# EAGLE schematic kolektorius_v2.2_ch340g (EAGLE 6.5.0)
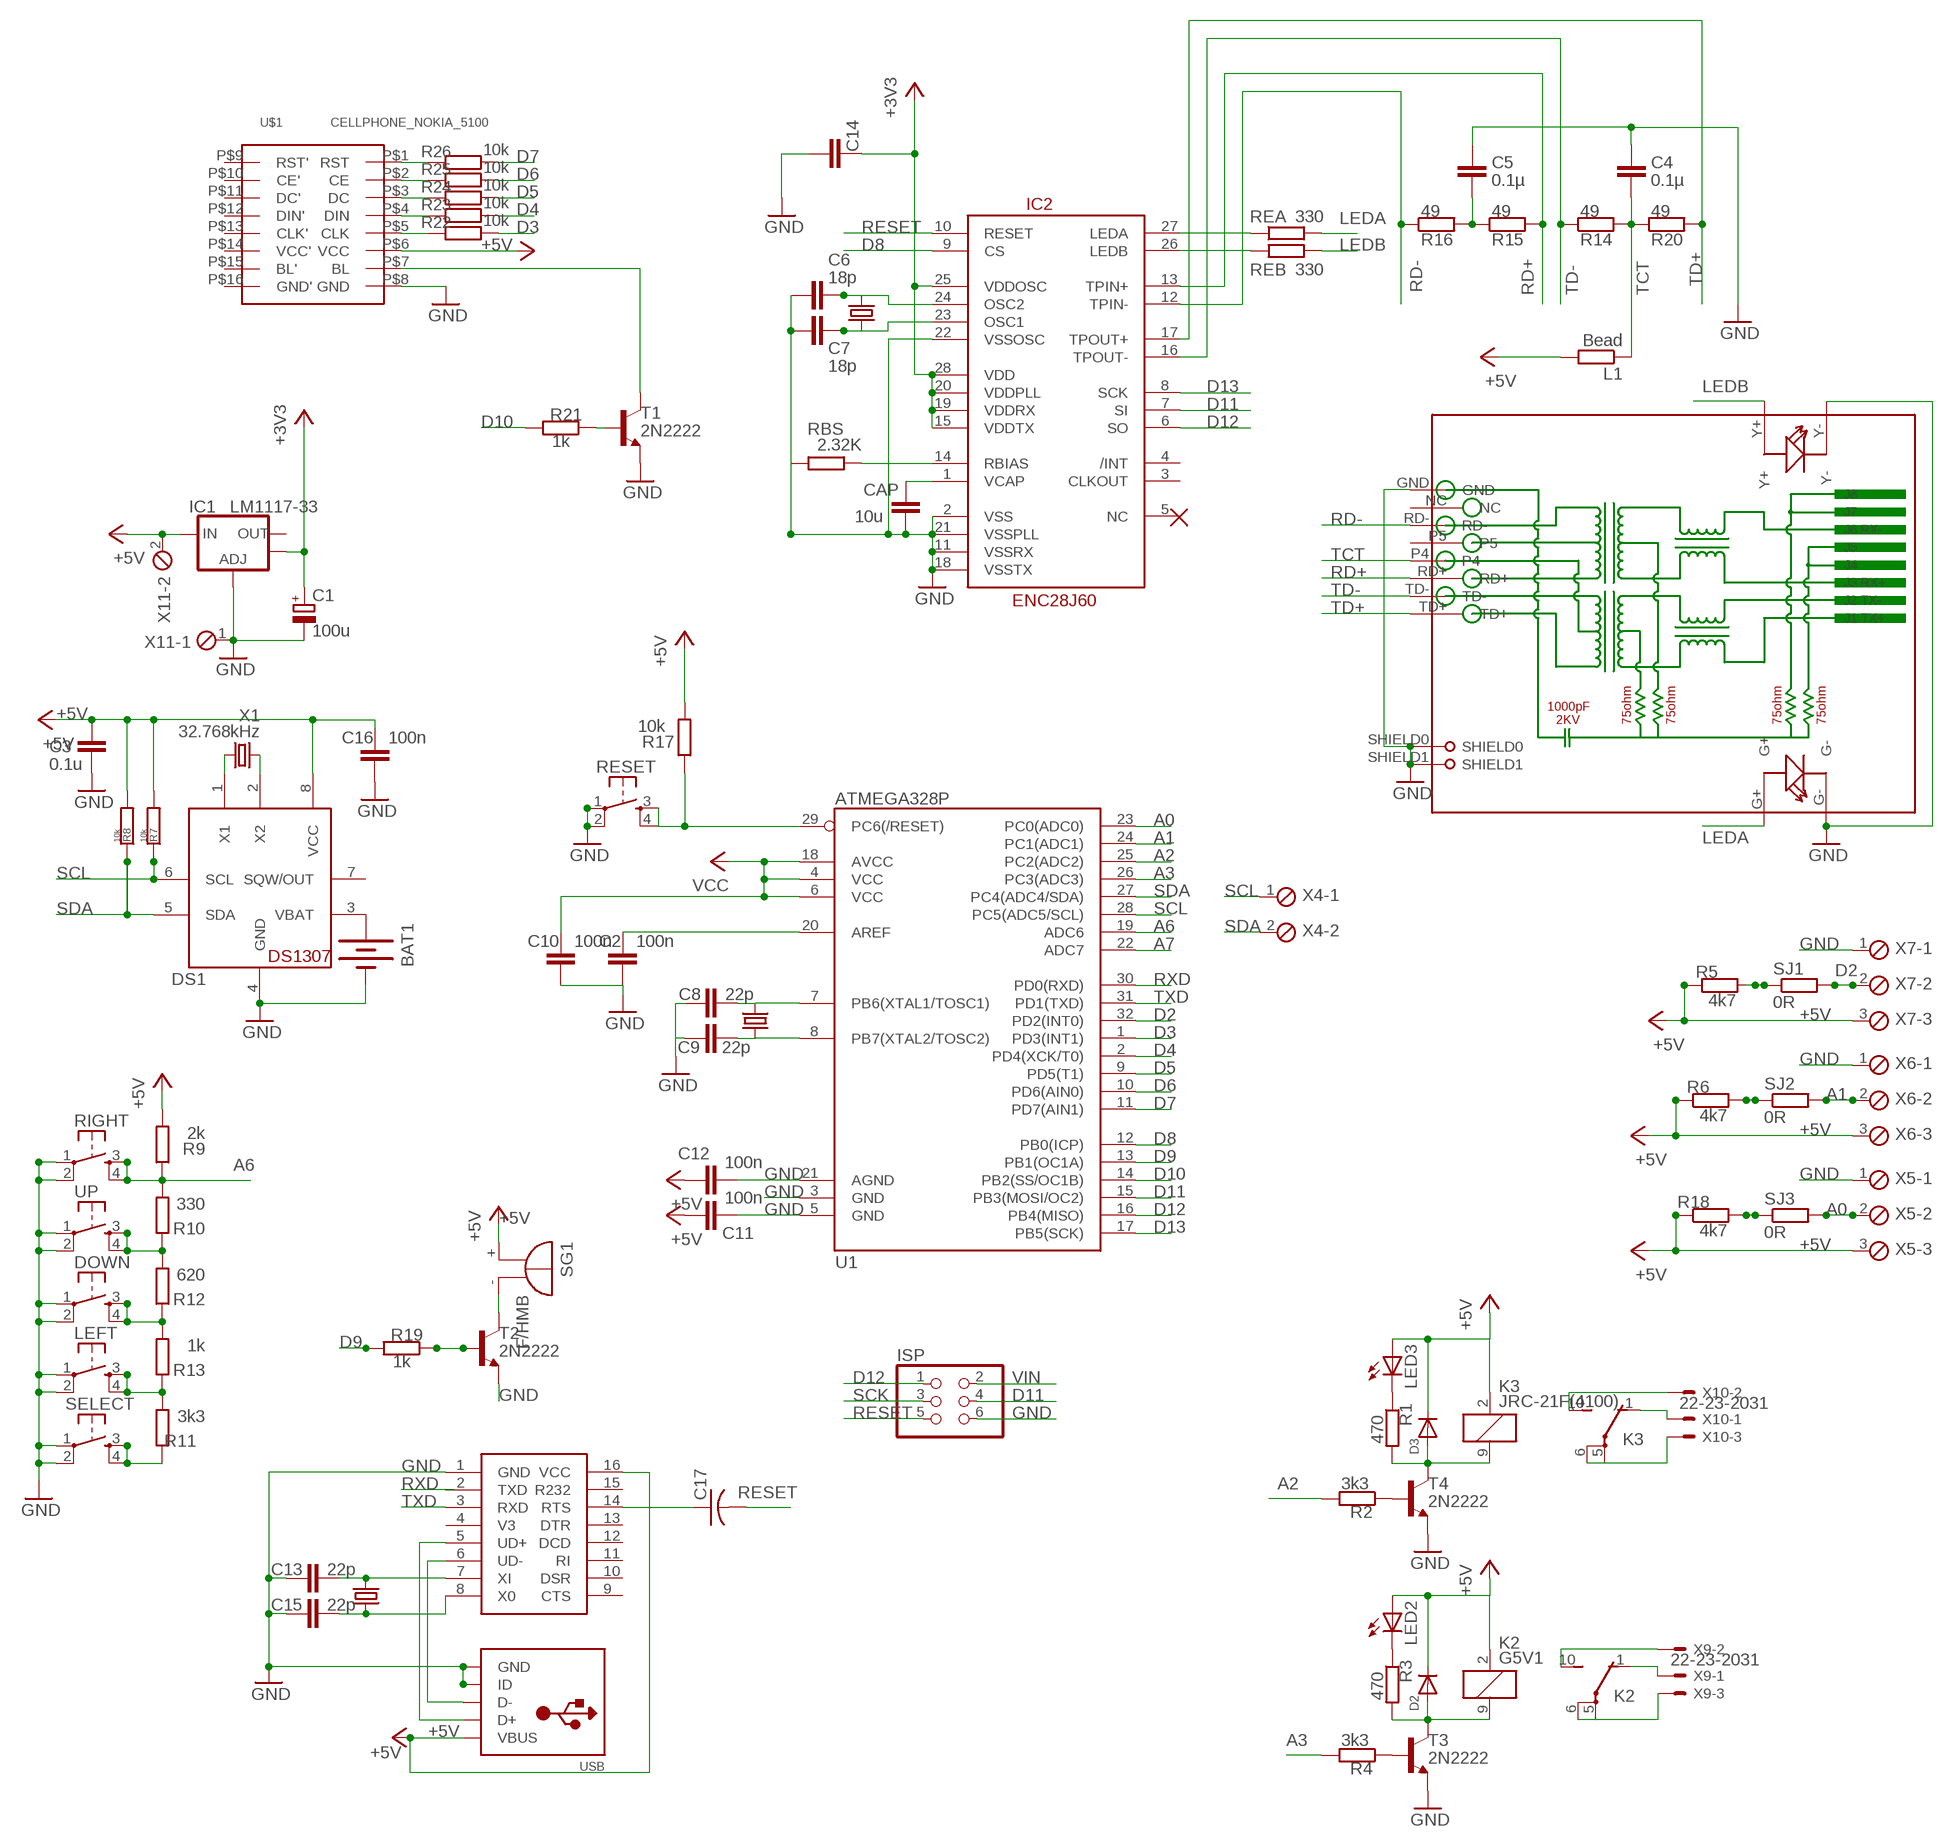
[diagram p0: schematic, sheet 1]

## Parts
BAT1  BATTERY20PTH  [BATTCOM_20MM_PTH]
C1  100u  CPOL-EUE2-5  [E2-5]
C2  100n  C-EUC0805  [C0805]
C3  0.1u  C-EUC0805  [C0805]
C4  0.1µ  C-EUC0805  [C0805]
C5  0.1µ  C-EUC0805  [C0805]
C6  18p  C-EUC0805  [C0805]
C7  18p  C-EUC0805  [C0805]
C8  22p  C-EUC0805  [C0805]
C9  22p  C-EUC0805  [C0805]
C10  100n  C-EUC0805  [C0805]
C11  100n  C-EUC0805  [C0805]
C12  100n  C-EUC0805  [C0805]
C13  22p  C-EUC0805  [C0805]
C14  100n  C-EUC0805  [C0805]
C15  22p  C-EUC0805  [C0805]
C16  100n  C-EUC0805  [C0805]
C17  C-USC0805K  [C0805K]
CAP  10u  C-EUC0805  [C0805]
D2  DIODEDO-1N4148  [DO-1N4148]
D3  DIODEDO-1N4148  [DO-1N4148]
DOWN  TAC_SWITCHPTH  [TACTILE-PTH]
DS1  DS1307  DS1307SOIC  [SO08]
IC1  LM1117-33  V_REG_LM1117SOT223  [SOT223]
IC2  ENC28J60  [SSOP28DB]
ISP  PINHD-2X3  [2X03]
K2  G5V1  [G5V1]
K3  JRC-21F(4100)  [G5V1]
L1  Bead  R-EU_R0805  [R0805]
LED2  LEDSMT1206  [1206]
LED3  LEDSMT1206  [1206]
LEFT  TAC_SWITCHPTH  [TACTILE-PTH]
R1  470  R-EU_R0805  [R0805]
R2  3k3  R-EU_R0805  [R0805]
R3  470  R-EU_R0805  [R0805]
R4  3k3  R-EU_R0805  [R0805]
R5  4k7  R-EU_R0805  [R0805]
R6  4k7  R-EU_R0805  [R0805]
R7  10k  R-EU_R0805  [R0805]
R8  10k  R-EU_R0805  [R0805]
R9  2k  R-EU_R0805  [R0805]
R10  330  R-EU_R0805  [R0805]
R11  3k3  R-EU_R0805  [R0805]
R12  620  R-EU_R0805  [R0805]
R13  1k  R-EU_R0805  [R0805]
R14  49  R-EU_R0805  [R0805]
R15  49  R-EU_R0805  [R0805]
R16  49  R-EU_R0805  [R0805]
R17  10k  R-EU_R0805  [R0805]
R18  4k7  R-EU_R0805  [R0805]
R19  1k  R-EU_R0805  [R0805]
R20  49  R-EU_R0805  [R0805]
R21  1k  R-EU_R0805  [R0805]
R22  10k  R-EU_R0805  [R0805]
R23  10k  R-EU_R0805  [R0805]
R24  10k  R-EU_R0805  [R0805]
R25  10k  R-EU_R0805  [R0805]
R26  10k  R-EU_R0805  [R0805]
RBS  2.32K  R-EU_R0805  [R0805]
REA  330  R-EU_R0805  [R0805]
REB  330  R-EU_R0805  [R0805]
RESET  TAC_SWITCHPTH  [TACTILE-PTH]
RIGHT  TAC_SWITCHPTH  [TACTILE-PTH]
RJ1  HR911105A  [HR911105A]
SELECT  TAC_SWITCHPTH  [TACTILE-PTH]
SG1  F/HMB  [F/HMB]
SJ1  0R  R-EU_R0402  [R0402]
SJ2  0R  R-EU_R0402  [R0402]
SJ3  0R  R-EU_R0402  [R0402]
T1  2N2222  [TO92-EBC-OVAL]
T2  2N2222  [TO92-EBC-OVAL]
T3  2N2222  [TO92-EBC-OVAL]
T4  2N2222  [TO92-EBC-OVAL]
U1  ATMEGA328P  ATMEGA328_SMT  [TQFP32-08]
U$1  CELLPHONE_NOKIA_5100  [CELLPHONE_NOKIA_5100_SPARKFUN]
U$2  CH340G  [SO016]
UP  TAC_SWITCHPTH  [TACTILE-PTH]
USB  USBMOLEX  [USB-MINIB-THM-MOLEX]
X1  32.768kHz  CRYSTALTC26H  [TC26H]
X2  16MHz  CRYSTALHC49US  [HC49US]
X3  25MHz  CRYSTALHC49US  [HC49US]
X4  MPT2  [2POL254]
X5  MPT3  [3POL254]
X6  MPT3  [3POL254]
X7  MPT3  [3POL254]
X9  22-23-2031  [22-23-2031]
X10  22-23-2031  [22-23-2031]
X11  MPT2  [2POL254]
X12  16MHz  CRYSTALHC49US  [HC49US]

## Nets
+3V3: C1.+ C14.1 IC1.4(OUT) IC2.15(VDDTX) IC2.19(VDDRX) IC2.20(VDDPLL) IC2.25(VDDOSC) IC2.28(VDD)
+5V: C3.1 C10.1 C11.2 C12.2 C16.1 D2.C D3.C DS1.8(VCC) IC1.3(IN) K2.2 K3.2 L1.2 LED2.A LED3.A R5.1 R6.1 R7.2 R8.2 R9.2 R17.2 R18.1 SG1.+ U1.4(VCC) U1.6(VCC) U1.18(AVCC) U$1.P$6(VCC) U$2.16(VCC) USB.VBUS X5.3 X6.3 X7.3 X11.2 ; supply symbol labelled VCC
A0: SJ3.2 U1.23(PC0(ADC0)) X5.2
A1: SJ2.2 U1.24(PC1(ADC1)) X6.2
A2: R2.2 U1.25(PC2(ADC2))
A3: R4.2 U1.26(PC3(ADC3))
A6: R9.1 R10.2 RIGHT.3 RIGHT.4 U1.19(ADC6)
A7: U1.22(ADC7)
D2: SJ1.2 U1.32(PD2(INT0)) X7.2
D3: R22.2 U1.1(PD3(INT1))
D4: R23.2 U1.2(PD4(XCK/T0))
D5: R24.2 U1.9(PD5(T1))
D6: R25.2 U1.10(PD6(AIN0))
D7: R26.2 U1.11(PD7(AIN1))
D8: IC2.9(CS) U1.12(PB0(ICP))
D9: R19.2 U1.13(PB1(OC1A))
D10: R21.2 U1.14(PB2(SS/OC1B))
D11: IC2.7(SI) ISP.4 U1.15(PB3(MOSI/OC2))
D12: IC2.6(SO) ISP.1 U1.16(PB4(MISO))
D13: IC2.8(SCK) U1.17(PB5(SCK))
GND: BAT1.2(-) C1.- C2.2 C3.2 C4.1 C5.1 C6.2 C7.2 C8.1 C9.1 C10.2 C11.1 C12.1 C13.1 C14.2 C15.1 C16.2 CAP.2 DOWN.1 DOWN.2 DS1.4(GND) IC1.1(ADJ) IC2.2(VSS) IC2.11(VSSRX) IC2.18(VSSTX) IC2.21(VSSPLL) IC2.22(VSSOSC) ISP.6 LEFT.1 LEFT.2 RBS.1 RESET.1 RESET.2 RIGHT.1 RIGHT.2 RJ1.G- RJ1.GND RJ1.SHIELD0 RJ1.SHIELD1 RJ1.Y- SELECT.1 SELECT.2 T1.E T2.E T3.E T4.E U1.3(GND) U1.5(GND) U1.21(AGND) U$1.P$8(GND) U$2.1(GND) UP.1 UP.2 USB.GND USB.ID X5.1 X6.1 X7.1 X11.1
LEDA: REA.2 RJ1.G+
LEDB: REB.2 RJ1.Y+
N$1: LEFT.3 LEFT.4 R11.2 R13.1
N$2: D2.A K2.9 R3.2 T3.C
N$3: R4.1 T3.B
N$4 [power]: K2.5(2:P) K2.6(2:P) X9.3
N$5: K2.10(2:S) X9.2
N$6: DOWN.3 DOWN.4 R12.1 R13.2
N$7: LED2.C R3.1
N$8: DS1.1(X1) X1.2
N$9: R10.1 R12.2 UP.3 UP.4
N$10: C13.2 U$2.7(XI) X12.2
N$11: U$2.6(UD-) USB.D-
N$12: D3.A K3.9 R1.2 T4.C
N$13: R2.1 T4.B
N$14: K2.1(2:O) X9.1
N$15: U$2.5(UD+) USB.D+
N$16: K3.10(2:S) X10.2
N$17: R6.2 SJ2.1
N$18: R11.1 SELECT.3 SELECT.4
N$19 [power]: K3.5(2:P) K3.6(2:P) X10.3
N$20: K3.1(2:O) X10.1
N$21: LED3.C R1.1
N$22: R22.1 U$1.P$5(CLK)
N$23: R25.1 U$1.P$2(CE)
N$24: R24.1 U$1.P$3(DC)
N$25: R23.1 U$1.P$4(DIN)
N$26 [signal]: T1.C U$1.P$7(BL)
N$27: R19.1 T2.B
N$28: R18.2 SJ3.1
N$29: SG1.- T2.C
N$30: DS1.2(X2) X1.1
N$31: R5.2 SJ1.1
N$32: C9.2 U1.8(PB7(XTAL2/TOSC2)) X2.1
N$33: C8.2 U1.7(PB6(XTAL1/TOSC1)) X2.2
N$34: IC2.27(LEDA) REA.1
N$35: C2.1 U1.20(AREF)
N$36: BAT1.1(+) DS1.3(VBAT)
N$37: IC2.26(LEDB) REB.1
N$39: CAP.1 IC2.1(VCAP)
N$40: C15.2 U$2.8(X0) X12.1
N$41: C6.1 IC2.24(OSC2) X3.2
N$42: C7.1 IC2.23(OSC1) X3.1
N$43: C17.1 U$2.14(RTS)
N$44: R21.1 T1.B
N$46: R17.1 RESET.3 RESET.4 U1.29(PC6(/RESET))
N$54: C5.2 R15.1 R16.2
N$59: IC2.14(RBIAS) RBS.2
RD+: IC2.13(TPIN+) R15.2 RJ1.RD+
RD-: IC2.12(TPIN-) R16.1 RJ1.RD-
RESET: C17.2 IC2.10(RESET) ISP.5
RXD: U1.30(PD0(RXD))
SCK: ISP.3
SCL: DS1.6(SCL) R7.1 U1.28(PC5(ADC5/SCL)) X4.1
SDA: DS1.5(SDA) R8.1 U1.27(PC4(ADC4/SDA)) X4.2
TCT: C4.2 L1.1 R14.2 R20.1 RJ1.P4
TD+: IC2.17(TPOUT+) R20.2 RJ1.TD+
TD-: IC2.16(TPOUT-) R14.1 RJ1.TD-
TXD: U1.31(PD1(TXD)) U$2.3(RXD)
V$: R26.1 U$1.P$1(RST)
VIN: ISP.2
Unconnected: DS1.7(SQW/OUT) IC1.2(OUT) IC2.3(CLKOUT) IC2.4(/INT) IC2.5(NC) RJ1.NC RJ1.P5 U$1.P$9(RST') U$1.P$10(CE') U$1.P$11(DC') U$1.P$12(DIN') U$1.P$13(CLK') U$1.P$14(VCC') U$1.P$15(BL') U$1.P$16(GND') U$2.2(TXD) U$2.4(V3) U$2.9(CTS) U$2.10(DSR) U$2.11(RI) U$2.12(DCD) U$2.13(DTR) U$2.15(R232)

## Library data of the parts
BAT1 = SparkFun-Electromechanical:BATTERY: Battery Holders Various common sizes : AA, AAA, 20mm coin cell and 12mm coin cell. 20MM_4LEGS, BATT-10373
C1 = resistor:CPOL-EU: POLARIZED CAPACITOR, European symbol
C2 C4-C16 CAP = resistor:C-EU: CAPACITOR, European symbol
C3 = rcl:C-EU: CAPACITOR, European symbol
C17 = rcl:C-US: CAPACITOR, American symbol
D2 D3 = adafruit:DIODE: Diode SMADIODE - SMA Surface Mount Package 20V 1A Schottky Diode Digikey: 641-1014-6-ND DO-1N4148 - Through Hole Small Current Diode SOD-123 20V 1 A (.5mV Vf) Schottky Diode - Digikey: MBRX120TPMSCT-ND SOD-323 10V 570mA (.38mV Vf, 3ns) Schottky Diode - Digikey: ZLLS410CT-ND SOD-523 30V 30mA Schottky Diode (RB751S-40TE61) - Digikey: RB751S-40TE61CT-ND SOT23-R/W - SOT23 Package (R = Solder Paste/Reflow Ovens, W = Hand-Soldering) BAT54Film 40V 300mA - Digikey: 497-7162-1-ND
DOWN LEFT RESET RIGHT SELECT UP = SparkFun-Electromechanical:TAC_SWITCH: Momentary Switch Button commonly used for reset or general input. Spark Fun Electronics SKU : COM-00097 SMT- SWCH-08247
DS1 = adafruit:DS1307: DS1307 Real time clock (RTC) with battery backup ability. Talk to it via i2c
IC1 = SparkFun:V_REG_LM1117: Voltage Regulator LM1117 Standard adjustable voltage regulator but in SMD form. Spark Fun Electronics SKU : COM-00595
IC2 = SparkFun-DigitalIC:ENC28J60: Microchip SPI 10Base ethernet IC
ISP = pinhead:PINHD-2X3: PIN HEADER
K2 = relay:G5V1: RELAY 1 x switch, 0.5 A/125 V AC, 1 A/24 V DC , Omron; MPN: G5V-1-DC24; OC_FARNELL: 9949593; OC_NEWARK: 36M6377
K3 = relay:JRC-21F(4100): RELAY 1 x switch, 0.5 A/125 V AC, 1 A/24 V DC , Omron; MPN: G5V-1-DC24; OC_FARNELL: 9949593; OC_NEWARK: 36M6377
L1 R1-R26 RBS REA REB SJ1-SJ3 = rcl:R-EU_: RESISTOR, European symbol
LED2 LED3 = adafruit:LED: LED OSRAM: - CHIPLED LG R971, LG N971, LY N971, LG Q971, LY Q971, LO R971, LY R971 LH N974, LH R974 LS Q976, LO Q976, LY Q976 LO Q996 - Hyper CHIPLED LW Q18S LB Q993, LB Q99A, LB R99A - SideLED LS A670, LO A670, LY A670, LG A670, LP A670 LB A673, LV A673, LT A673, LW A673 LH A674 LY A675 LS A676, LA A676, LO A676, LY A676, LW A676 LS A679, LY A679, LG A679 - Hyper Micro SIDELED® LS Y876, LA Y876, LO Y876, LY Y876 LT Y87S - SmartLED LW L88C, LW L88S LB L89C, LB L89S, LG L890 LS L89K, LO L89K, LY L89K LS L896, LA L896, LO L896, LY L896 - TOPLED LS T670, LO T670, LY T670, LG T670, LP T670 LSG T670, LSP T670, LSY T670, LOP T670, LYG T670 LG T671, LOG T671, LSG T671 LB T673, LV T673, LT T673, LW T673 LH T674 LS T676, LA T676, LO T676, LY T676, LB T676, LH T676, LSB T676, LW T676 LB T67C, LV T67C, LT T67C, LS T67K, LO T67K, LY T67K, LW E67C LS E67B, LA E67B, LO E67B, LY E67B, LB E67C, LV E67C, LT E67C LW T67C LS T679, LY T679, LG T679 LS T770, LO T770, LY T770, LG T770, LP T770 LB T773, LV T773, LT T773, LW T773 LH T774 LS E675, LA E675, LY E675, LS T675 LS T776, LA T776, LO T776, LY T776, LB T776 LHGB T686 LT T68C, LB T68C - Hyper Mini TOPLED® LB M676 - Mini TOPLED Santana® LG M470 LS M47K, LO M47K, LY M47K Source: http://www.osram.convergy.de/
RJ1 = CONNECTER:HR911105A
SG1 = buzzer:F/HMB: BUZZER Source: Buerklin; OC_FARNELL: unknown; OC_NEWARK: unknown
T1-T4 = adafruit:2N2222: NPN TRANSISTOR Big oval pads
U1 = SparkFun-DigitalIC:ATMEGA328_SMT: 32-Pin Atmega328 part Commonly used on Arduino compatible boards Available in QFP and QFN packages TQFP is IC-09069 QFN is non-stock; PROD_ID: IC-09069
U$1 = DIY-Cellphone:CELLPHONE_NOKIA_5100
U$2 = ch340:CH340G: CH340G
USB = adafruit:USB: USB Connectors USBMINIB - Surface Mount Female Mini-B USB Connector 4UConnector: 06564 By microbuilder.eu Thru-hole RA Female Mini-B USB Connector 4UConnector: 18732 By ladyada.net
X1 = crystal:CRYSTAL: CRYSTAL; OC_FARNELL: unknown; OC_NEWARK: unknown
X2 X3 X12 = SparkFun:CRYSTAL: Crystals Various standard crystals. Proven footprints. Spark Fun Electronics SKU : COM-00534
X4 X11 = con-phoenix-254:MPT2: PHOENIX CONNECTOR; OC_FARNELL: unknown; OC_NEWARK: unknown
X5-X7 = con-phoenix-254:MPT3: PHOENIX CONNECTOR; OC_FARNELL: unknown; OC_NEWARK: unknown
X9 X10 = con-molex:22-23-2031: .100" (2.54mm) Center Header - 3 Pin; MF: MOLEX; MPN: 22-23-2031; OC_FARNELL: 1462950; OC_NEWARK: 30C0862

## Net classes
0 default: width 0.406 mm, clearance 0.203 mm
1 power: width 0.61 mm, clearance 0.203 mm
2 GND: width 0.61 mm
3 signal: width 0.457 mm